# Altium schematic sheet Fuente Alimentacion.SchDoc
size Legal; SheetNumber: 2; SheetTotal: 8
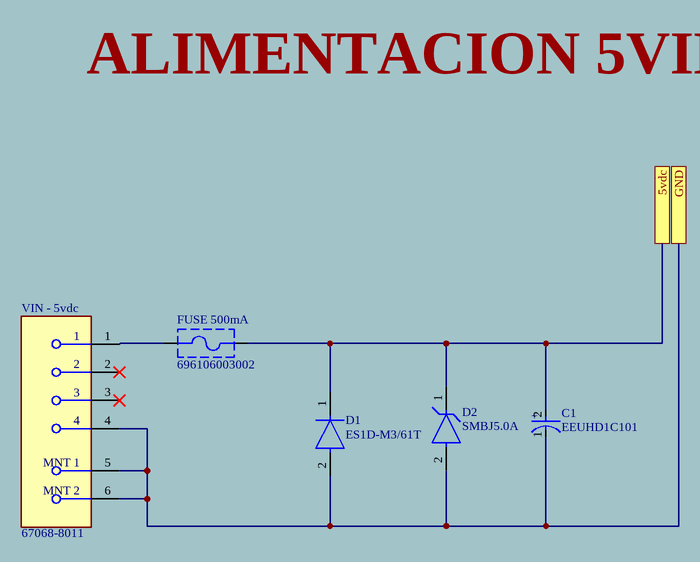
[diagram p0: Fuente Alimentacion.SchDoc]

## Parts
C1  EEUHD1C101  [FP-RAD-TH-D_5_0_5-L_11_1-MFG]
D1  ES1D-M3/61T  [FP-SMA-MFG]
D2  SMBJ5.0A  [FP-SMBJ-MFG]
FUSE_500mA  696106003002  [696106003002]
VIN_-_5vdc  67068-8011  [FP-67068-8011-MFG]

## Ports
5vdc, GND

## Nets
5vdc: C1.2(A) D1.1(C) D2.1(C) FUSE_500mA.1 ; port 5vdc
GND: C1.1(C) D1.2(A) D2.2(A) VIN_-_5vdc.4 VIN_-_5vdc.5(MNT_1) VIN_-_5vdc.6(MNT_2) ; port GND
NetFUSE_500mA_2: FUSE_500mA.2 VIN_-_5vdc.1

Not connected (* = marked no-connect by the designer): VIN_-_5vdc 2* 3*

## Notes on the sheet
- ALIMENTACION 5VIN
- (in symbol CMP-05427-000949-1) +

## Library data of the parts
C1 = CMP-05427-000949-1: Aluminum Electrolytic Capacitors (Radial Lead Type) AEC-Q200 Qualified 100uF ±20% 16V; Lead/Base Style: Straight; Life (Hours): 1000Hour; Polarity: Polar; Ripple Current: 110mA; Lead Diameter: 0.5mm; Packaging: Bulk; Tolerance: 20%; Package Quantity: 200; Lead Pitch: 2.5mm; RoHS Compliant: Yes; Length: 11mm; Capacitance: 100uF; Max Operating Temperature: 105°C; REACH SVHC: No SVHC; Termination: Radial; Lead Free: Lead Free; Number of Pins: 2; Ripple Current (AC): 110mA; Mount: Through Hole; Diameter: 5mm; Min Operating Temperature: -55°C; Construction: RADIAL; Voltage Rating: 16V; Voltage Rating (DC): 16V; Case/Package: Radial; Height: 11mm; Height - Seated (Max): 0.492inch; Voltage: 16V; Series: HD
D1 = CMP-02540-000096-1: DIODE GEN PURP 200V 1A DO214AC; Reverse Recovery Time: 25ns; Forward Voltage: 920mV; Max Reverse Current: 5uA; Element Configuration: Single; Max Surge Current: 30A; Min Operating Temperature: -55°C; Reverse Voltage: 200V; Case/Package: DO-214AC; Number of Pins: 2; Average Rectified Current: 1A; Series: -; Package Quantity: 1800; Recovery Time: 25ns; Max Operating Temperature: 150°C; Packaging: Tape and Reel; Peak Non-Repetitive Surge Current: 30A; Max Reverse Voltage (DC): 200V; Mount: Surface Mount; RoHS Compliant: Yes
D2 = CMP-08607-000042-1: TVS DIODE 5V 9.2V DO214AA; Manufacturer: Littelfuse Inc; Breakdown Voltage: 6.4V; Direction: Unidirectional; Peak Pulse Current: 65.3A; Max Junction Temp: +150°C; Number Of Channels: 1; Peak Pulse Power: 600W; Clamping Voltage: 9.2V; Octopart: https://octopart.com/smbj5.0a-littelfuse-8835; Package: SMBJ; RoHS: TRUE; Temperature Range Low: -65°C; Device Class L2: TVS Diodes; Automotive: No; ComponentLink2URL: https://www.littelfuse.com/~/media/electronics/datasheets/tvs_diodes/littelfuse_tvs_diode_smbj_datasheet.pdf.pdf; Height: 2.61mm; ComponentLink2Description: Datasheet; Temperature: -65°C to +150°C; Category: Diode; Temperature Range High: +150°C; Lead Free: Yes; Digikey Description: TVS DIODE 5V 9.2V DO214AA; Device Class L1: Circuit Protection; Reverse Standoff Voltage: 5V; Device Class L3: unset; Manufacturer Part Number: SMBJ5.0A; Mouser Description: TVSS; Diode; For Data/Comm; Industrial Equip; 65.3A; SMD; Solder Term; Clamp-V 9.2V
FUSE_500mA = CMP-1502-00235-2: NexarPartId: 56808805; Fuse Current: 10A; Voltage Rating (AC): 250V; RoHS: Non-Compliant; Min Operating Temperature: -30°C; Height: 11.6mm; Packaging: Box; Mount: Through Hole; REACH SVHC: Unknown; Max Operating Temperature: 120°C
VIN_-_5vdc = CMP-00257-00942133-1: 67068-8011 Conn USB 2.0 Type B RCP 4 POS 2.5mm Solder RA Thru-Hole 4 Terminal 1 Port USB 2.0 Tray; NexarPartId: 942133; Number of Contacts: 4; Connector Type: Receptacle, USB; Gender: Receptacle; USB Standard: USB 2.0; Current Rating: 1.5A; Max Voltage Rating (AC): 30V; Number of Ports: 1; Lead Pitch: 2.5mm; Depth: 17mm; Length: 12mm; Orientation: Right Angle; Max Operating Temperature: 50°C; Termination: Solder; Number of Circuits: 4; REACH SVHC: Unknown; Schedule B: 8536695050; RoHS: Compliant; Voltage Rating: 30V; Number of Rows: 2; Number of Positions: 4; Housing Material: Nylon; Contact Plating: Gold; Height: 11.25mm; Number of Terminals: 4; Min Operating Temperature: 0°C; Mount: Through Hole; Pitch: 2.5mm; Radiation Hardening: No; Contact Material: Bronze, Gold, Nickel; Color: White